# Altium project PDU-UV17.PrjPcb
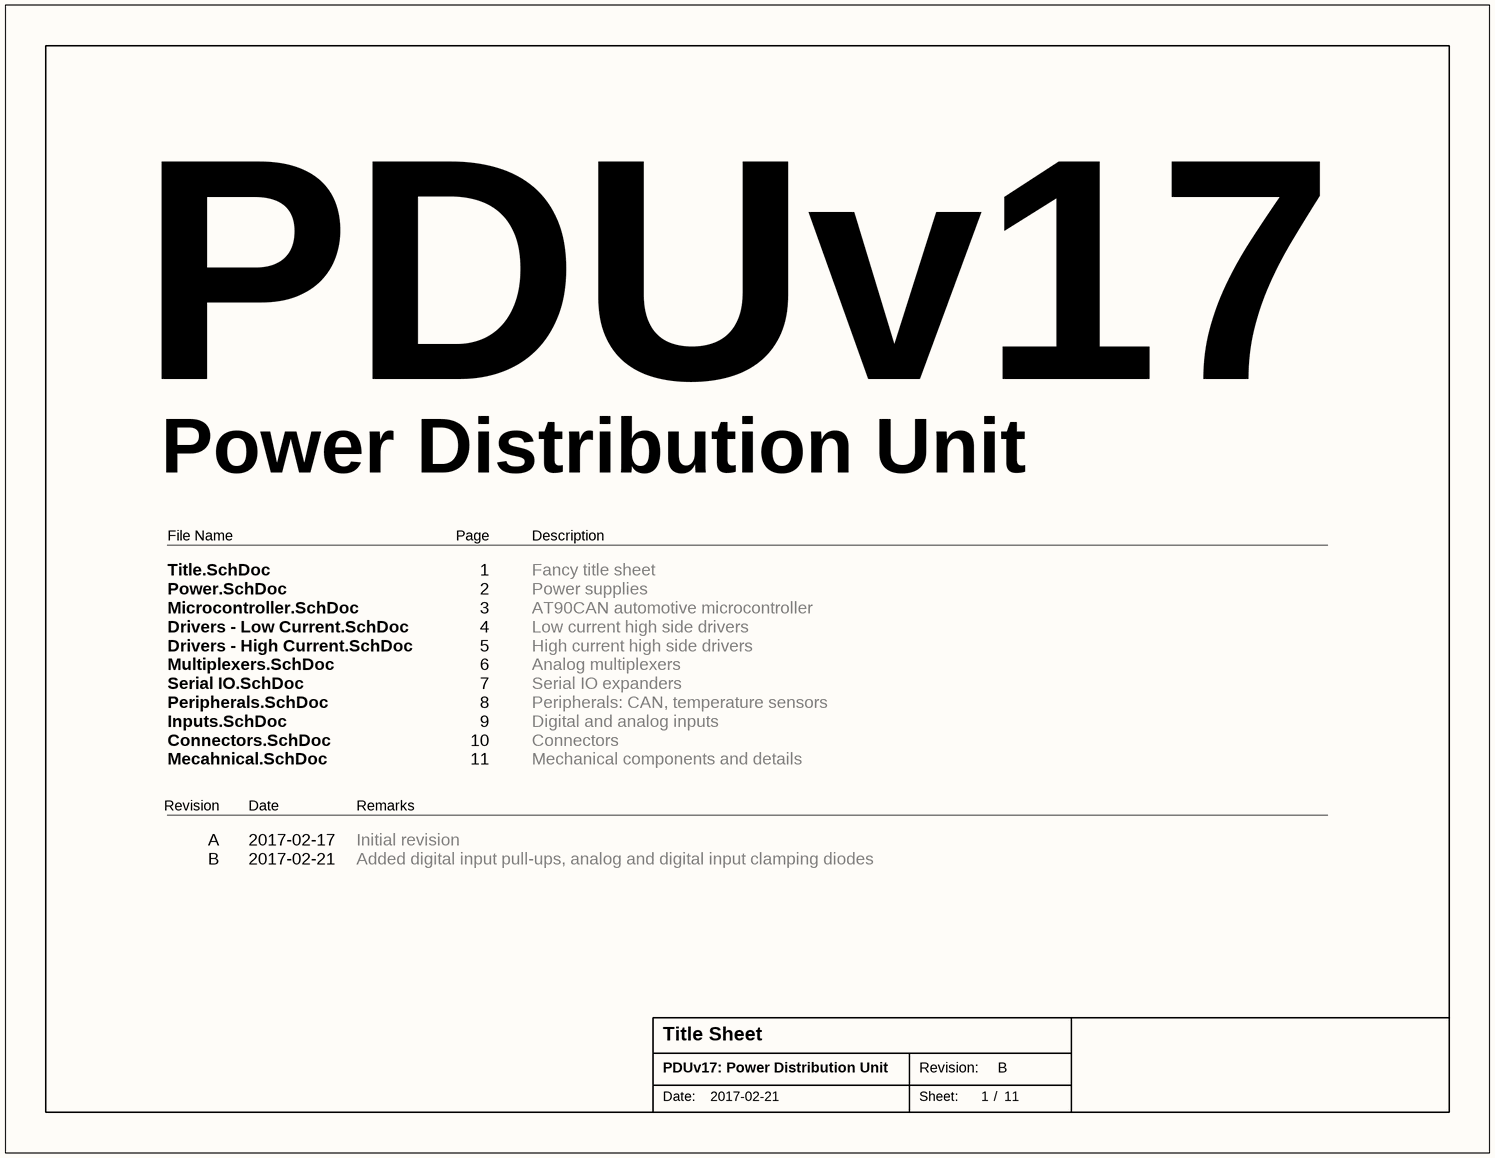
[diagram p0: Title.SchDoc]
ProjectDate: 2017-02-21; ProjectTitle: PDUv17: Power Distribution Unit; ProjectRevision: B; ProjectCar: UV17
11 sheets, 126 parts. Net scope: global (net labels, ports and power ports of the same name join across sheets).
Board file: PDU-UV17.PcbDoc
Sheets:
  Title.SchDoc
  Power.SchDoc
  Microcontroller.SchDoc
  Drivers - Low Current.SchDoc
  Drivers - High Current.SchDoc
  Multiplexers.SchDoc
  Serial IO.SchDoc
  Peripherals.SchDoc
  Inputs.SchDoc
  Connectors.SchDoc
  Mechanical.SchDoc

## Sheet Title.SchDoc: Title Sheet
size Letter; Date: 2017-02-17; Revision: A; SheetNumber: 1; SheetTotal: 11; ProjectTitle: PDUv17: Power Distribution Unit

### Notes on the sheet
- PDUv17
- Power Distribution Unit
- File Name
- Page
- Description
- Title.SchDoc
  Power.SchDoc
  Microcontroller.SchDoc
  Drivers - Low Current.SchDoc
  Drivers - High Current.SchDoc
  Multiplexers.SchDoc
  Serial IO.SchDoc
  Peripherals.SchDoc
  Inputs.SchDoc
  Connectors.SchDoc
  Mecahnical.SchDoc
- 1
  2
  3
  4
  5
  6
  7
  8
  9
  10
  11
- Fancy title sheet
  Power supplies
  AT90CAN automotive microcontroller
  Low current high side drivers
  High current high side drivers
  Analog multiplexers
  Serial IO expanders
  Peripherals: CAN, temperature sensors
  Digital and analog inputs
  Connectors
  Mechanical components and details
- Revision
- Date
- Remarks
- A
  B
- 2017-02-17
  2017-02-21
- Initial revision
  Added digital input pull-ups, analog and digital input clamping diodes
- Date:
- Revision:
- Sheet:
- /

## Sheet Power.SchDoc: Power Supplies
size Letter; Date: 2017-02-17; Revision: A; SheetNumber: 2; SheetTotal: 11; ProjectTitle: PDUv17: Power Distribution Unit
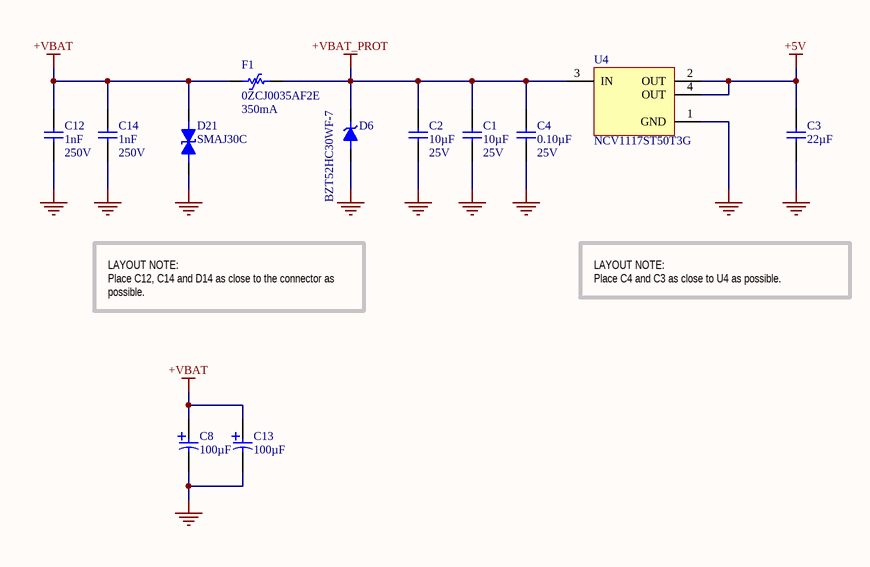
[diagram p1: Power.SchDoc]

### Parts
C1  value 10µF  Voltage: 25V  [CAP-1206-M]  (hidden comment: CAP 10µF ±10% 25V 1206 X7R)
C2  value 10µF  Voltage: 25V  [CAP-1206-M]  (hidden comment: CAP 10µF ±10% 25V 1206 X7R)
C3  value 22µF  [CAP-1206-M]  (hidden comment: CAP 22µF ±10% 10V 1206 X7R)
C4  value 0.10µF  Voltage: 25V  [CAP-0402-M]  (hidden comment: CAP 0.10µF ±10% 25V 0402 X7R)
C8  value 100µF  [CAPAE7066X80M]  (hidden comment: EEE-FK1V101XP)
C12  value 1nF  Voltage: 250V  [CAP-0805-M]  (hidden comment: CAP 1nF ±10% 250V 0805 X7R)
C13  value 100µF  [CAPAE7066X80M]  (hidden comment: EEE-FK1V101XP)
C14  value 1nF  Voltage: 250V  [CAP-0805-M]  (hidden comment: CAP 1nF ±10% 250V 0805 X7R)
D6  BZT52HC30WF-7  [SODFL340X115-2N]
D21  SMAJ30C  [SON127P500X135-2N]
F1  0ZCJ0035AF2E  value 350mA  [0ZCJ-1206-0.9]
U4  NCV1117ST50T3G  [SOT230P700X180-4N]

### Nets
+5V: C3.2 U4.2(OUT) U4.4(OUT)
+VBAT: C8.2 C12.1 C13.2 C14.1 D21.1 F1.1
+VBAT_PROT: C1.2 C2.2 C4.2 D6.1(K) F1.2 U4.3(IN)
GND: C1.1 C2.1 C3.1 C4.1 C8.1 C12.2 C13.1 C14.2 D6.2(A) D21.2 U4.1(GND)

### Notes on the sheet
- LAYOUT NOTE:
  Place C12, C14 and D14 as close to the connector as possible.
- LAYOUT NOTE:
  Place C4 and C3 as close to U4 as possible.
- Date:
- Revision:
- Sheet:
- /

### Library data of the parts
C1 C2 = CC1206KKX7R8BB106: Manufacturer: Yageo; Manufacturer Series: CC; Part Number: CC1206KKX7R8BB106; Component Type: Standard; Tolerance: ±10%; Package: 1206; Temperature Coefficient: X7R; Temperature Range: -55°C ~ 125°C; Supplier 1: Digi-Key; Supplier Part Number 1: 311-1959-1-ND
C3 = CC1206KKX7R6BB226: Manufacturer: Yageo; Manufacturer Series: CC; Part Number: CC1206KKX7R6BB226; Component Type: Standard; Tolerance: ±10%; Voltage: 10V; Package: 1206; Temperature Coefficient: X7R; Temperature Range: -55°C ~ 125°C; Supplier 1: Digi-Key; Supplier Part Number 1: 311-1954-1-ND
C4 = CC0402KRX7R8BB104: Manufacturer: Yageo; Manufacturer Series: CC; Part Number: CC0402KRX7R8BB104; Component Type: Standard; Tolerance: ±10%; Package: 0402; Temperature Coefficient: X7R; Temperature Range: -55°C ~ 125°C; Supplier 1: Digi-Key; Supplier Part Number 1: 311-2077-1-ND
C12 C14 = CC0805KRX7RYBB102: Manufacturer: Yageo; Manufacturer Series: CC; Part Number: CC0805KRX7RYBB102; Component Type: Standard; Tolerance: ±10%; Package: 0805; Temperature Coefficient: X7R; Temperature Range: -55°C ~ 125°C; Supplier 1: Digi-Key; Supplier Part Number 1: 311-1470-1-ND
C8 C13 = EEE-FK1V101XP: Supplier 1: Digi-Key; Supplier Part Number 1: PCE3836CT-ND
D6 = BZT52HC30WF-7: Supplier 1: Digi-Key; Supplier Part Number 1: BZT52HC30WF-7DICT-ND
U4 = NCV1117ST50T3G: Supplier 1: Digi-Key; Supplier Part Number 1: NCV1117ST50T3GOSCT-ND

## Sheet Microcontroller.SchDoc: Microcontroller
size Letter; Date: 2017-02-17; Revision: A; SheetNumber: 3; SheetTotal: 11; ProjectTitle: PDUv17: Power Distribution Unit
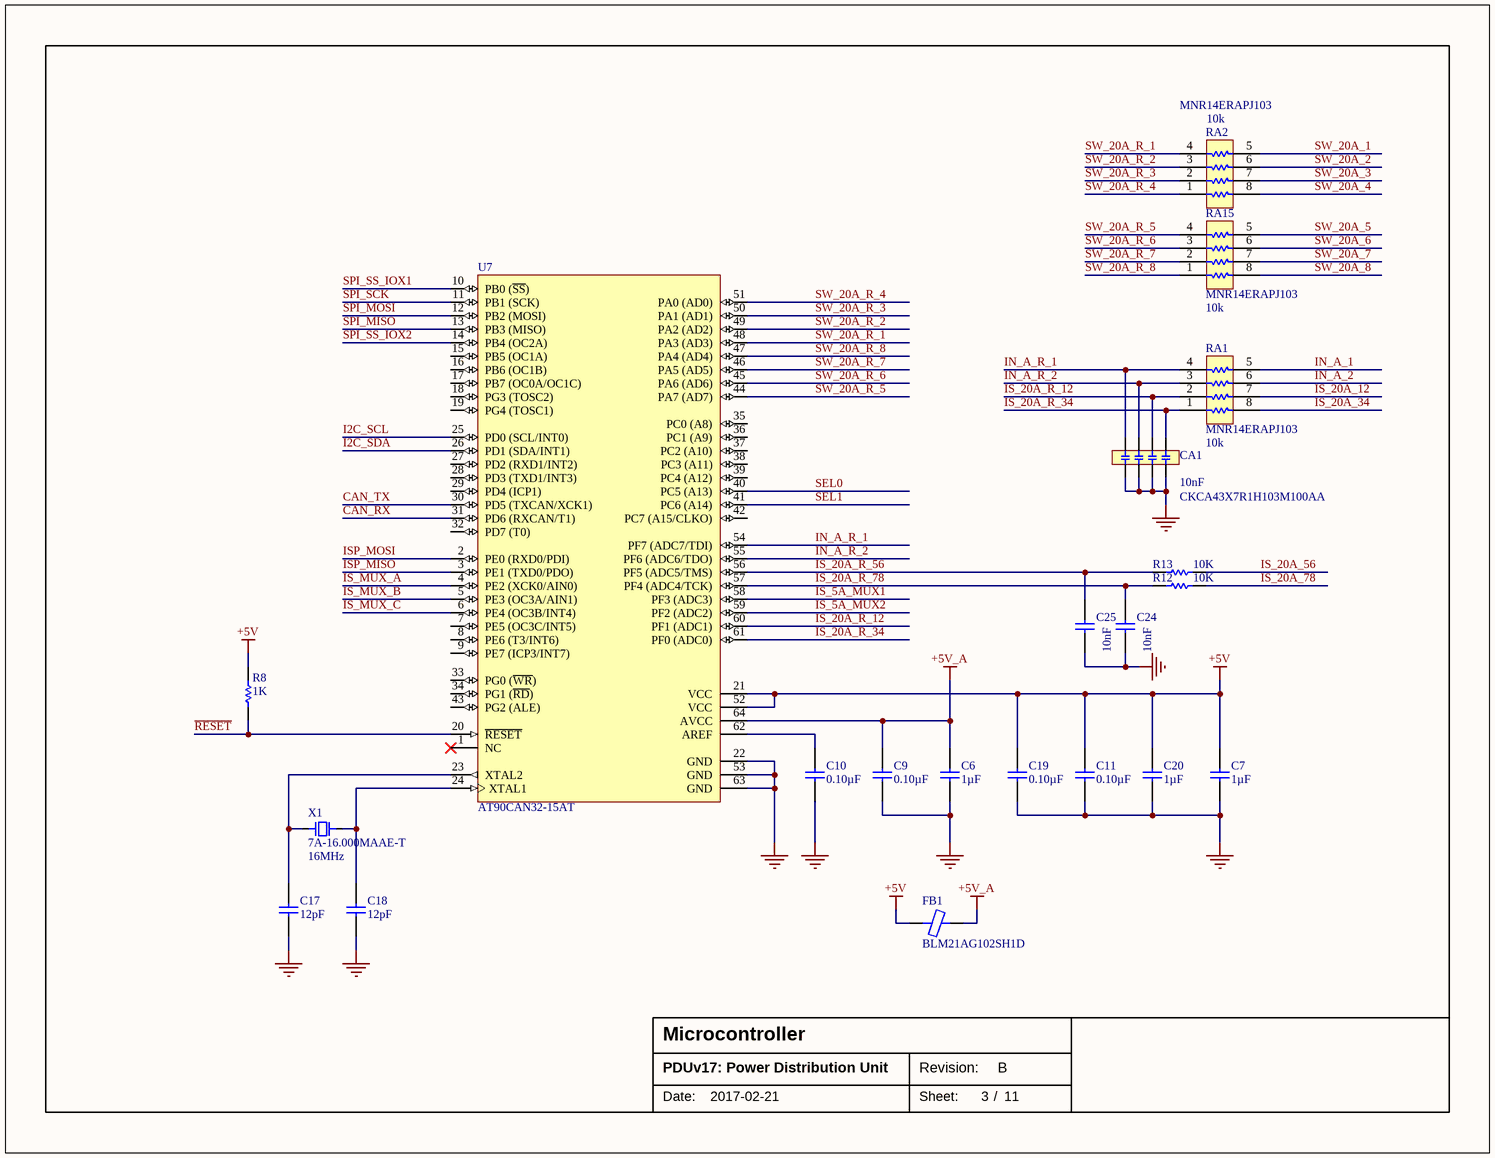
[diagram p2: Microcontroller.SchDoc]

### Parts
C6  value 1µF  [CAP-0805-M]  (hidden comment: CAP 1µF ±10% 16V 0805 X7R)
C7  value 1µF  [CAP-0805-M]  (hidden comment: CAP 1µF ±10% 16V 0805 X7R)
C9  value 0.10µF  [CAP-0402-M]  (hidden comment: CAP 0.10µF ±10% 16V 0402 X7R)
C10  value 0.10µF  [CAP-0402-M]  (hidden comment: CAP 0.10µF ±10% 16V 0402 X7R)
C11  value 0.10µF  [CAP-0402-M]  (hidden comment: CAP 0.10µF ±10% 16V 0402 X7R)
C17  value 12pF  [CAP-0402-M]  (hidden comment: CAP 12pF ±5% 50V 0402 C0G, NP0)
C18  value 12pF  [CAP-0402-M]  (hidden comment: CAP 12pF ±5% 50V 0402 C0G, NP0)
C19  value 0.10µF  [CAP-0402-M]  (hidden comment: CAP 0.10µF ±10% 16V 0402 X7R)
C20  value 1µF  [CAP-0805-M]  (hidden comment: CAP 1µF ±10% 16V 0805 X7R)
C24  value 10nF  [CAP-0402-M]  (hidden comment: CAP 10000pF ±10% 16V 0402 X7R)
C25  value 10nF  [CAP-0402-M]  (hidden comment: CAP 10000pF ±10% 16V 0402 X7R)
CA1  CKCA43X7R1H103M100AA  value 10nF  [CAF-80P319X159-8N]
FB1  BLM21AG102SH1D  [INDC2012X11N]
R8  value 1K  [RES-0603-M]  (hidden comment: RES 1K 1% 1/10 W 0603 ±100ppm/°C)
R12  value 10K  [RES-0603-M]  (hidden comment: RES 10K 1% 1/10 W 0603 ±100ppm/°C)
R13  value 10K  [RES-0603-M]  (hidden comment: RES 10K 1% 1/10 W 0603 ±100ppm/°C)
RA1  MNR14ERAPJ103  value 10k  [CAC-80P319X150-8N]
RA2  MNR14ERAPJ103  value 10k  [CAC-80P319X150-8N]
RA15  MNR14ERAPJ103  value 10k  [CAC-80P319X150-8N]
U7  AT90CAN32-15AT  [TQFP80P1600X1600X120-64N]
X1  7A-16.000MAAE-T  value 16MHz  [QFN200P500X320X135-2N]

### Nets
+5V: C7.1 C11.2 C19.2 C20.1 FB1.1 R8.1 U7.21(VCC) U7.52(VCC)
+5V_A: C6.1 C9.2 FB1.2 U7.64(AVCC)
GND: C6.2 C7.2 C9.1 C10.1 C11.1 C17.1 C18.1 C19.1 C20.2 C24.1 C25.1 CA1.1 CA1.2 CA1.3 CA1.4 U7.22(GND) U7.53(GND) U7.63(GND)
CAN_RX: U7.31(PD6_(RXCAN/T1))
CAN_TX: U7.30(PD5_(TXCAN/XCK1))
I2C_SCL: U7.25(PD0_(SCL/INT0))
I2C_SDA: U7.26(PD1_(SDA/INT1))
IN_A_1: RA1.5
IN_A_2: RA1.6
IN_A_R_1: CA1.5 RA1.4 U7.54(PF7_(ADC7/TDI))
IN_A_R_2: CA1.6 RA1.3 U7.55(PF6_(ADC6/TDO))
IS_5A_MUX1: U7.58(PF3_(ADC3))
IS_5A_MUX2: U7.59(PF2_(ADC2))
IS_20A_12: RA1.7
IS_20A_34: RA1.8
IS_20A_56: R13.1
IS_20A_78: R12.1
IS_20A_R_12: CA1.7 RA1.2 U7.60(PF1_(ADC1))
IS_20A_R_34: CA1.8 RA1.1 U7.61(PF0_(ADC0))
IS_20A_R_56: C25.2 R13.2 U7.56(PF5_(ADC5/TMS))
IS_20A_R_78: C24.2 R12.2 U7.57(PF4_(ADC4/TCK))
IS_MUX_A: U7.4(PE2_(XCK0/AIN0))
IS_MUX_B: U7.5(PE3_(OC3A/AIN1))
IS_MUX_C: U7.6(PE4_(OC3B/INT4))
ISP_MISO: U7.3(PE1_(TXD0/PDO))
ISP_MOSI: U7.2(PE0_(RXD0/PDI))
~{RESET}: R8.2 U7.20(~{RESET})
SEL0: U7.40(PC5_(A13))
SEL1: U7.41(PC6_(A14))
SPI_MISO: U7.13(PB3_(MISO))
SPI_MOSI: U7.12(PB2_(MOSI))
SPI_SCK: U7.11(PB1_(SCK))
SPI_SS_IOX1: U7.10(PB0_(~{SS}))
SPI_SS_IOX2: U7.14(PB4_(OC2A))
SW_20A_1: RA2.5
SW_20A_2: RA2.6
SW_20A_3: RA2.7
SW_20A_4: RA2.8
SW_20A_5: RA15.5
SW_20A_6: RA15.6
SW_20A_7: RA15.7
SW_20A_8: RA15.8
SW_20A_R_1: RA2.4 U7.48(PA3_(AD3))
SW_20A_R_2: RA2.3 U7.49(PA2_(AD2))
SW_20A_R_3: RA2.2 U7.50(PA1_(AD1))
SW_20A_R_4: RA2.1 U7.51(PA0_(AD0))
SW_20A_R_5: RA15.4 U7.44(PA7_(AD7))
SW_20A_R_6: RA15.3 U7.45(PA6_(AD6))
SW_20A_R_7: RA15.2 U7.46(PA5_(AD5))
SW_20A_R_8: RA15.1 U7.47(PA4_(AD4))
NetC10_2: C10.2 U7.62(AREF)
NetC17_2: C17.2 U7.23(XTAL2) X1.1
NetC18_2: C18.2 U7.24(XTAL1) X1.2

Not connected (* = marked no-connect by the designer): U7 1(NC)* 7(PE5_(OC3C/INT5)) 8(PE6_(T3/INT6)) 9(PE7_(ICP3/INT7)) 15(PB5_(OC1A)) 16(PB6_(OC1B)) 17(PB7_(OC0A/OC1C)) 18(PG3_(TOSC2)) 19(PG4_(TOSC1)) 27(PD2_(RXD1/INT2)) 28(PD3_(TXD1/INT3)) 29(PD4_(ICP1)) 32(PD7_(T0)) 33(PG0_(~{WR})) 34(PG1_(~{RD})) 35(PC0_(A8)) 36(PC1_(A9)) 37(PC2_(A10)) 38(PC3_(A11)) 39(PC4_(A12)) 42(PC7_(A15/CLKO)) 43(PG2_(ALE))

### Notes on the sheet
- Date:
- Revision:
- Sheet:
- /

### Library data of the parts
C6 C7 C20 = CC0805KKX7R7BB105: Manufacturer: Yageo; Manufacturer Series: CC; Part Number: CC0805KKX7R7BB105; Component Type: Standard; Tolerance: ±10%; Voltage: 16V; Package: 0805; Temperature Coefficient: X7R; Temperature Range: -55°C ~ 125°C; Supplier 1: Digi-Key; Supplier Part Number 1: 311-1365-1-ND
C9-C11 C19 = CC0402KRX7R7BB104: Manufacturer: Yageo; Manufacturer Series: CC; Part Number: CC0402KRX7R7BB104; Component Type: Standard; Tolerance: ±10%; Voltage: 16V; Package: 0402; Temperature Coefficient: X7R; Temperature Range: -55°C ~ 125°C; Supplier 1: Digi-Key; Supplier Part Number 1: 311-1338-1-ND
C17 C18 = CC0402JRNPO9BN120: Manufacturer: Yageo; Manufacturer Series: CC; Part Number: CC0402JRNPO9BN120; Component Type: Standard; Tolerance: ±5%; Voltage: 50V; Package: 0402; Temperature Coefficient: C0G, NP0; Temperature Range: -55°C ~ 125°C; Supplier 1: Digi-Key; Supplier Part Number 1: 311-1016-1-ND
C24 C25 = CC0402KRX7R7BB103: Manufacturer: Yageo; Manufacturer Series: CC; Part Number: CC0402KRX7R7BB103; Component Type: Standard; Tolerance: ±10%; Voltage: 16V; Package: 0402; Temperature Coefficient: X7R; Temperature Range: -55°C ~ 125°C; Supplier 1: Digi-Key; Supplier Part Number 1: 311-1042-1-ND
R8 = RC0603FR-071KL: Manufacturer: Yageo; Manufacturer Series: RC; Power: 1/10 W; Part Number: RC0603FR-071KL; Component Type: Standard; Tolerance: 1%; Package: 0603; Temperature Coefficient: ±100ppm/°C; Temperature Range: -55°C ~ 155°C; Supplier 1: Digi-Key; Supplier Part Number 1: 311-1.00KHRCT-ND
R12 R13 = RC0603FR-0710KL: Manufacturer: Yageo; Manufacturer Series: RC; Power: 1/10 W; Part Number: RC0603FR-0710KL; Component Type: Standard; Tolerance: 1%; Package: 0603; Temperature Coefficient: ±100ppm/°C; Temperature Range: -55°C ~ 155°C; Supplier 1: Digi-Key; Supplier Part Number 1: 311-10.0KHRCT-ND
X1 = 7A-16.000MAAE-T: SMD Crystal Oscillator 12 pF; Load Capacitance: 12pF; Supplier 1: Digi-Key; Supplier Part Number 1: 887-1747-1-ND
FB1 = BLM21AG102SH1D: Supplier 1: Digi-Key; Supplier Part Number 1: 490-10664-1-ND
U7 = AT90CAN32-15AT: Supplier 1: Digi-Key; Supplier Part Number 1: AT90CAN32-15ATCT-ND

## Sheet Drivers - Low Current.SchDoc: Low Current Drivers
size Letter; Date: 2017-02-17; Revision: A; SheetNumber: 4; SheetTotal: 11; ProjectTitle: PDUv17: Power Distribution Unit
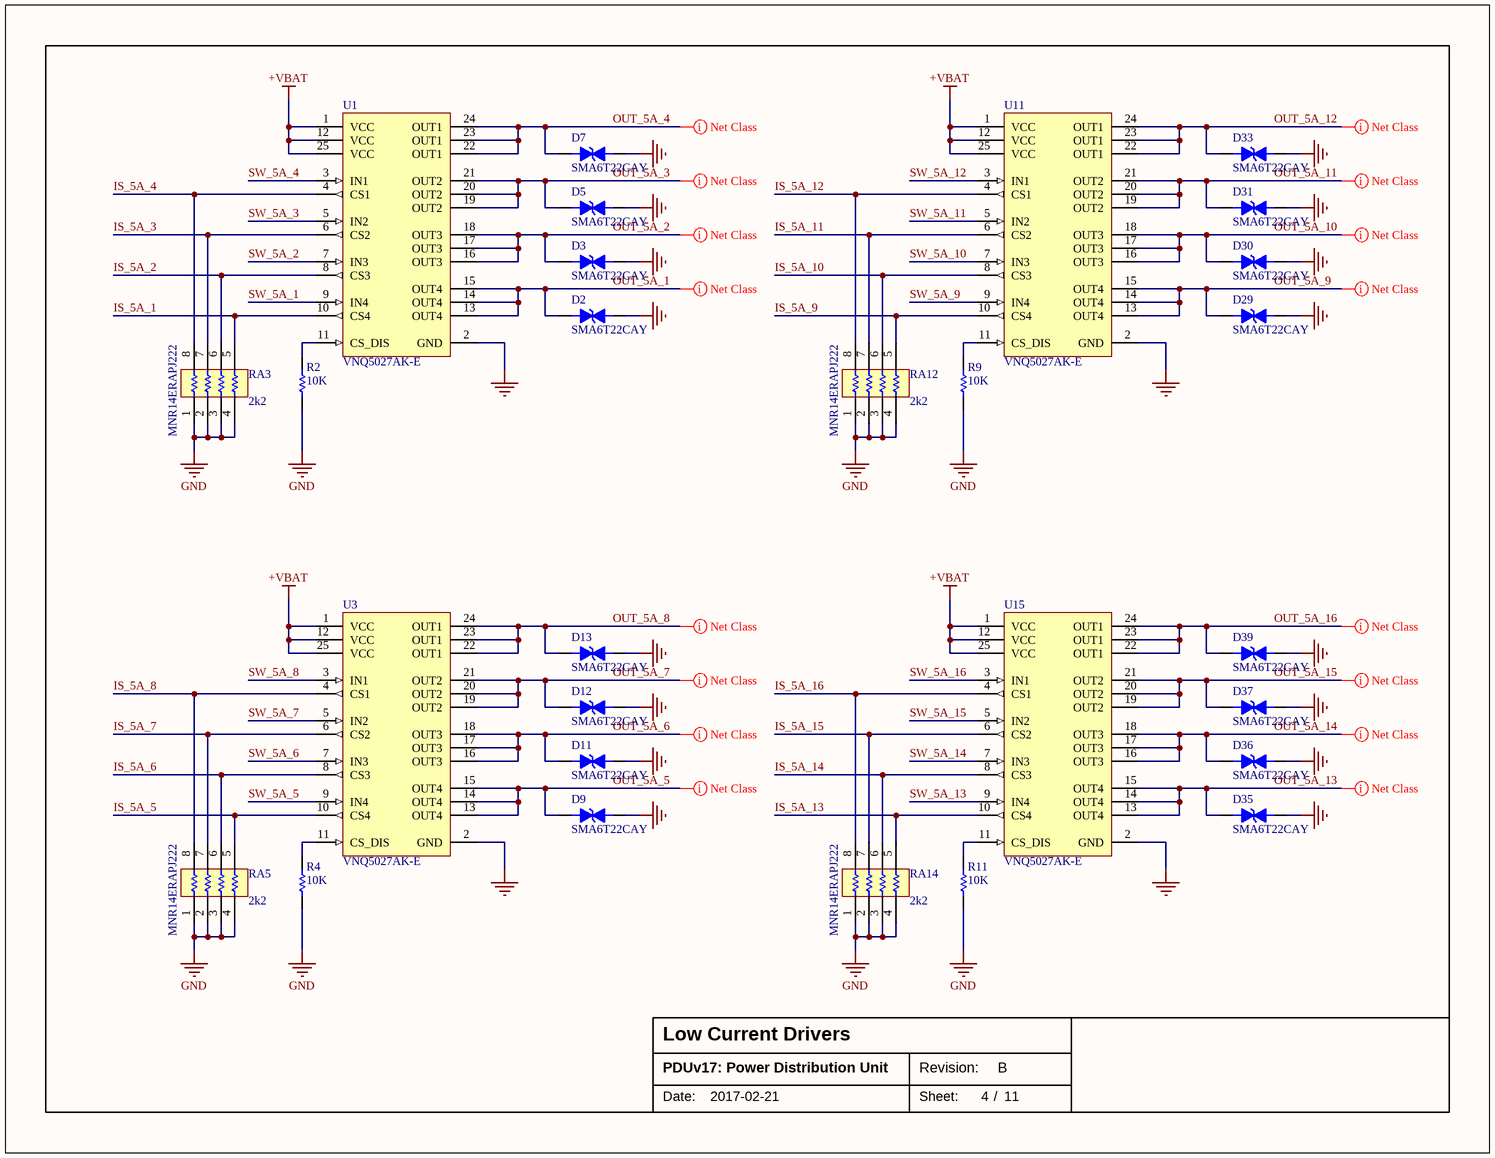
[diagram p3: Drivers - Low Current.SchDoc]

### Parts
D2  SMA6T22CAY  [DIOM4326X25N]
D3  SMA6T22CAY  [DIOM4326X25N]
D5  SMA6T22CAY  [DIOM4326X25N]
D7  SMA6T22CAY  [DIOM4326X25N]
D9  SMA6T22CAY  [DIOM4326X25N]
D11  SMA6T22CAY  [DIOM4326X25N]
D12  SMA6T22CAY  [DIOM4326X25N]
D13  SMA6T22CAY  [DIOM4326X25N]
D29  SMA6T22CAY  [DIOM4326X25N]
D30  SMA6T22CAY  [DIOM4326X25N]
D31  SMA6T22CAY  [DIOM4326X25N]
D33  SMA6T22CAY  [DIOM4326X25N]
D35  SMA6T22CAY  [DIOM4326X25N]
D36  SMA6T22CAY  [DIOM4326X25N]
D37  SMA6T22CAY  [DIOM4326X25N]
D39  SMA6T22CAY  [DIOM4326X25N]
R2  value 10K  [RES-0603-M]  (hidden comment: RES 10K 1% 1/10 W 0603 ±100ppm/°C)
R4  value 10K  [RES-0603-M]  (hidden comment: RES 10K 1% 1/10 W 0603 ±100ppm/°C)
R9  value 10K  [RES-0603-M]  (hidden comment: RES 10K 1% 1/10 W 0603 ±100ppm/°C)
R11  value 10K  [RES-0603-M]  (hidden comment: RES 10K 1% 1/10 W 0603 ±100ppm/°C)
RA3  MNR14ERAPJ222  value 2k2  [CAC-80P319X150-8N]
RA5  MNR14ERAPJ222  value 2k2  [CAC-80P319X150-8N]
RA12  MNR14ERAPJ222  value 2k2  [CAC-80P319X150-8N]
RA14  MNR14ERAPJ222  value 2k2  [CAC-80P319X150-8N]
U1  VNQ5027AK-E  [SOP80P1030X245_HS-25N]
U3  VNQ5027AK-E  [SOP80P1030X245_HS-25N]
U11  VNQ5027AK-E  [SOP80P1030X245_HS-25N]
U15  VNQ5027AK-E  [SOP80P1030X245_HS-25N]

### Nets
+VBAT: U1.1(VCC) U1.12(VCC) U1.25(VCC) U3.1(VCC) U3.12(VCC) U3.25(VCC) U11.1(VCC) U11.12(VCC) U11.25(VCC) U15.1(VCC) U15.12(VCC) U15.25(VCC)
GND: D2.1(K) D3.1(K) D5.1(K) D7.1(K) D9.1(K) D11.1(K) D12.1(K) D13.1(K) D29.1(K) D30.1(K) D31.1(K) D33.1(K) D35.1(K) D36.1(K) D37.1(K) D39.1(K) R2.1 R4.1 R9.1 R11.1 RA3.1 RA3.2 RA3.3 RA3.4 RA5.1 RA5.2 RA5.3 RA5.4 RA12.1 RA12.2 RA12.3 RA12.4 RA14.1 RA14.2 RA14.3 RA14.4 U1.2(GND) U3.2(GND) U11.2(GND) U15.2(GND)
IS_5A_1: RA3.5 U1.10(CS4)
IS_5A_2: RA3.6 U1.8(CS3)
IS_5A_3: RA3.7 U1.6(CS2)
IS_5A_4: RA3.8 U1.4(CS1)
IS_5A_5: RA5.5 U3.10(CS4)
IS_5A_6: RA5.6 U3.8(CS3)
IS_5A_7: RA5.7 U3.6(CS2)
IS_5A_8: RA5.8 U3.4(CS1)
IS_5A_9: RA12.5 U11.10(CS4)
IS_5A_10: RA12.6 U11.8(CS3)
IS_5A_11: RA12.7 U11.6(CS2)
IS_5A_12: RA12.8 U11.4(CS1)
IS_5A_13: RA14.5 U15.10(CS4)
IS_5A_14: RA14.6 U15.8(CS3)
IS_5A_15: RA14.7 U15.6(CS2)
IS_5A_16: RA14.8 U15.4(CS1)
OUT_5A_1: D2.2(A) U1.13(OUT4) U1.14(OUT4) U1.15(OUT4)
OUT_5A_2: D3.2(A) U1.16(OUT3) U1.17(OUT3) U1.18(OUT3)
OUT_5A_3: D5.2(A) U1.19(OUT2) U1.20(OUT2) U1.21(OUT2)
OUT_5A_4: D7.2(A) U1.22(OUT1) U1.23(OUT1) U1.24(OUT1)
OUT_5A_5: D9.2(A) U3.13(OUT4) U3.14(OUT4) U3.15(OUT4)
OUT_5A_6: D11.2(A) U3.16(OUT3) U3.17(OUT3) U3.18(OUT3)
OUT_5A_7: D12.2(A) U3.19(OUT2) U3.20(OUT2) U3.21(OUT2)
OUT_5A_8: D13.2(A) U3.22(OUT1) U3.23(OUT1) U3.24(OUT1)
OUT_5A_9: D29.2(A) U11.13(OUT4) U11.14(OUT4) U11.15(OUT4)
OUT_5A_10: D30.2(A) U11.16(OUT3) U11.17(OUT3) U11.18(OUT3)
OUT_5A_11: D31.2(A) U11.19(OUT2) U11.20(OUT2) U11.21(OUT2)
OUT_5A_12: D33.2(A) U11.22(OUT1) U11.23(OUT1) U11.24(OUT1)
OUT_5A_13: D35.2(A) U15.13(OUT4) U15.14(OUT4) U15.15(OUT4)
OUT_5A_14: D36.2(A) U15.16(OUT3) U15.17(OUT3) U15.18(OUT3)
OUT_5A_15: D37.2(A) U15.19(OUT2) U15.20(OUT2) U15.21(OUT2)
OUT_5A_16: D39.2(A) U15.22(OUT1) U15.23(OUT1) U15.24(OUT1)
SW_5A_1: U1.9(IN4)
SW_5A_2: U1.7(IN3)
SW_5A_3: U1.5(IN2)
SW_5A_4: U1.3(IN1)
SW_5A_5: U3.9(IN4)
SW_5A_6: U3.7(IN3)
SW_5A_7: U3.5(IN2)
SW_5A_8: U3.3(IN1)
SW_5A_9: U11.9(IN4)
SW_5A_10: U11.7(IN3)
SW_5A_11: U11.5(IN2)
SW_5A_12: U11.3(IN1)
SW_5A_13: U15.9(IN4)
SW_5A_14: U15.7(IN3)
SW_5A_15: U15.5(IN2)
SW_5A_16: U15.3(IN1)
NetR2_2: R2.2 U1.11(CS_DIS)
NetR4_2: R4.2 U3.11(CS_DIS)
NetR9_2: R9.2 U11.11(CS_DIS)
NetR11_2: R11.2 U15.11(CS_DIS)

### Layout directives
net class OUT_5A: OUT_5A_1, OUT_5A_2, OUT_5A_3, OUT_5A_4, OUT_5A_5, OUT_5A_6, OUT_5A_7, OUT_5A_8, OUT_5A_9, OUT_5A_10, OUT_5A_11, OUT_5A_12, OUT_5A_13, OUT_5A_14, OUT_5A_15, OUT_5A_16

### Notes on the sheet
- Date:
- Revision:
- Sheet:
- /

### Library data of the parts
R2 R4 R9 R11 = RC0603FR-0710KL: as R12 on sheet Microcontroller; Part Number: RC0603FR-0710KL; Component Type: Standard; Tolerance: 1%; Package: 0603; Temperature Coefficient: ±100ppm/°C; Temperature Range: -55°C ~ 155°C; Supplier 1: Digi-Key; Supplier Part Number 1: 311-10.0KHRCT-ND
U1 U3 U11 U15 = VNQ5027AK-E: Supplier 1: Digi-Key; Supplier Part Number 1: 497-11715-1-ND

## Sheet Drivers - High Current.SchDoc: High Current Drivers
size Letter; Date: 2017-02-17; Revision: A; SheetNumber: 5; SheetTotal: 11; ProjectTitle: PDUv17: Power Distribution Unit
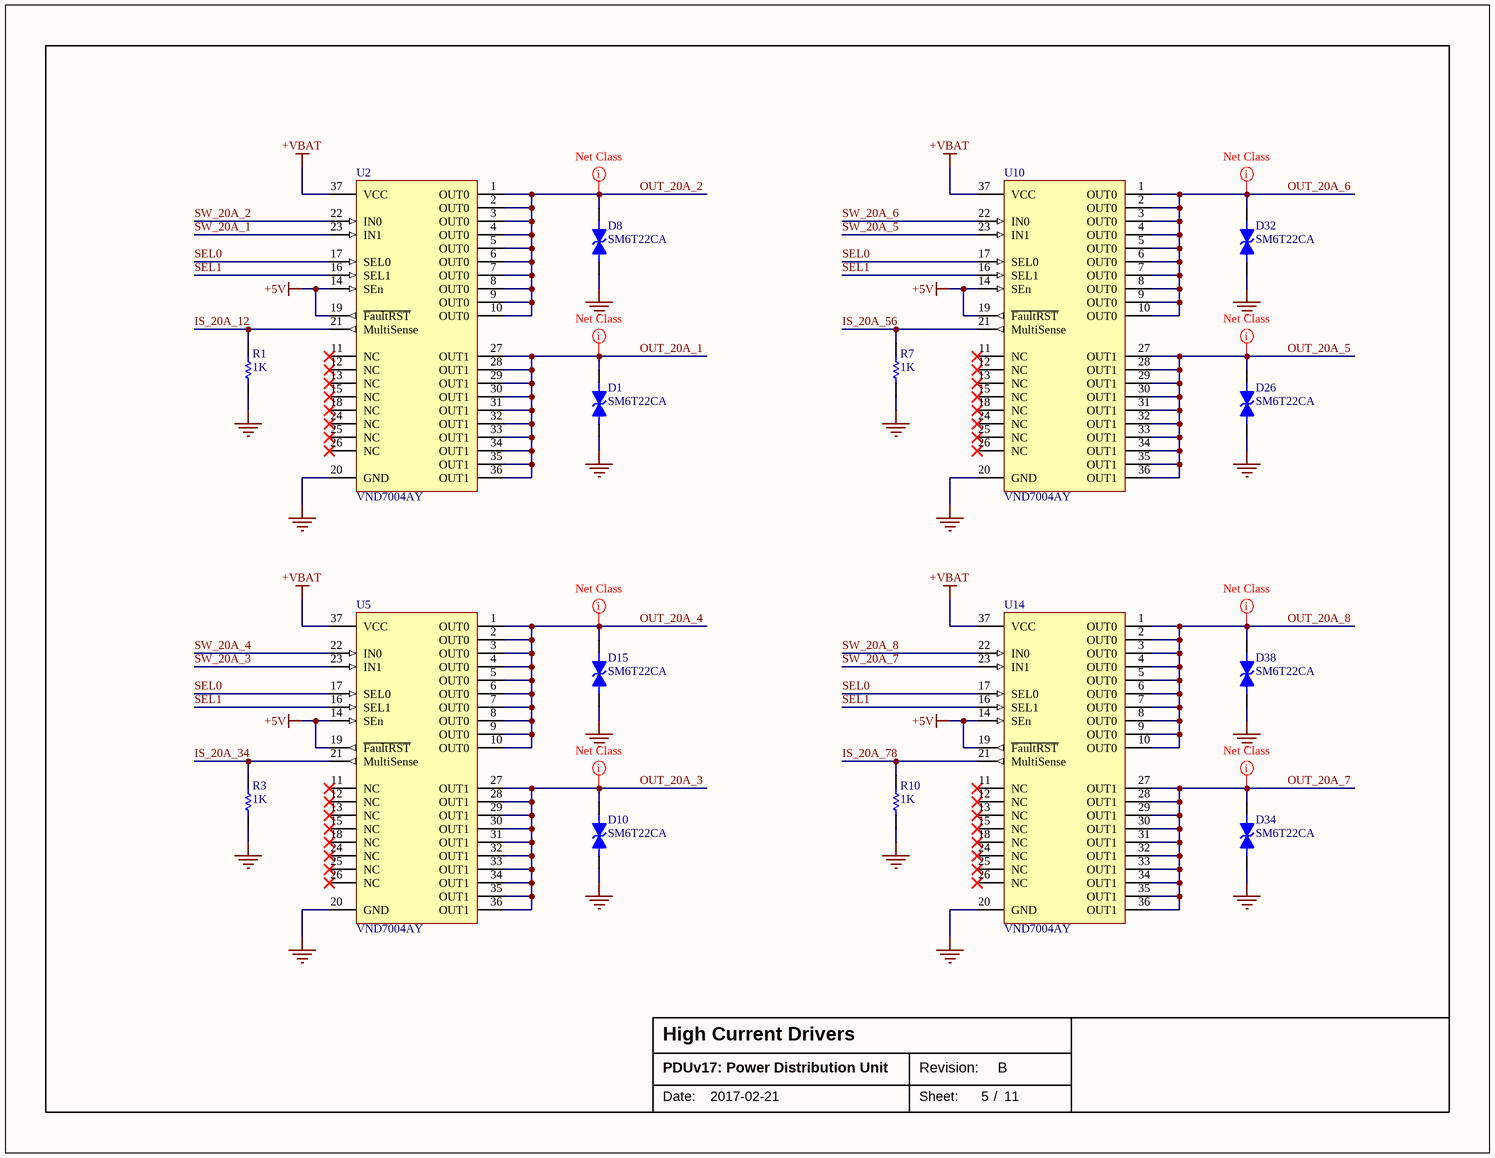
[diagram p4: Drivers - High Current.SchDoc]

### Parts
D1  SM6T22CA  [SM6T]
D8  SM6T22CA  [SM6T]
D10  SM6T22CA  [SM6T]
D15  SM6T22CA  [SM6T]
D26  SM6T22CA  [SM6T]
D32  SM6T22CA  [SM6T]
D34  SM6T22CA  [SM6T]
D38  SM6T22CA  [SM6T]
R1  value 1K  [RES-0603-M]  (hidden comment: RES 1K 1% 1/10 W 0603 ±100ppm/°C)
R3  value 1K  [RES-0603-M]  (hidden comment: RES 1K 1% 1/10 W 0603 ±100ppm/°C)
R7  value 1K  [RES-0603-M]  (hidden comment: RES 1K 1% 1/10 W 0603 ±100ppm/°C)
R10  value 1K  [RES-0603-M]  (hidden comment: RES 1K 1% 1/10 W 0603 ±100ppm/°C)
U2  VND7004AY  [SSOP50P1030X265_HS-37N]
U5  VND7004AY  [SSOP50P1030X265_HS-37N]
U10  VND7004AY  [SSOP50P1030X265_HS-37N]
U14  VND7004AY  [SSOP50P1030X265_HS-37N]

### Nets
+5V: U2.14(SEn) U2.19(~{FaultRST}) U5.14(SEn) U5.19(~{FaultRST}) U10.14(SEn) U10.19(~{FaultRST}) U14.14(SEn) U14.19(~{FaultRST})
+VBAT: U2.37(VCC) U5.37(VCC) U10.37(VCC) U14.37(VCC)
GND: D1.1(K) D8.1(K) D10.1(K) D15.1(K) D26.1(K) D32.1(K) D34.1(K) D38.1(K) R1.1 R3.1 R7.1 R10.1 U2.20(GND) U5.20(GND) U10.20(GND) U14.20(GND)
IS_20A_12: R1.2 U2.21(MultiSense)
IS_20A_34: R3.2 U5.21(MultiSense)
IS_20A_56: R7.2 U10.21(MultiSense)
IS_20A_78: R10.2 U14.21(MultiSense)
OUT_20A_1: D1.2(A) U2.27(OUT1) U2.28(OUT1) U2.29(OUT1) U2.30(OUT1) U2.31(OUT1) U2.32(OUT1) U2.33(OUT1) U2.34(OUT1) U2.35(OUT1) U2.36(OUT1)
OUT_20A_2: D8.2(A) U2.1(OUT0) U2.2(OUT0) U2.3(OUT0) U2.4(OUT0) U2.5(OUT0) U2.6(OUT0) U2.7(OUT0) U2.8(OUT0) U2.9(OUT0) U2.10(OUT0)
OUT_20A_3: D10.2(A) U5.27(OUT1) U5.28(OUT1) U5.29(OUT1) U5.30(OUT1) U5.31(OUT1) U5.32(OUT1) U5.33(OUT1) U5.34(OUT1) U5.35(OUT1) U5.36(OUT1)
OUT_20A_4: D15.2(A) U5.1(OUT0) U5.2(OUT0) U5.3(OUT0) U5.4(OUT0) U5.5(OUT0) U5.6(OUT0) U5.7(OUT0) U5.8(OUT0) U5.9(OUT0) U5.10(OUT0)
OUT_20A_5: D26.2(A) U10.27(OUT1) U10.28(OUT1) U10.29(OUT1) U10.30(OUT1) U10.31(OUT1) U10.32(OUT1) U10.33(OUT1) U10.34(OUT1) U10.35(OUT1) U10.36(OUT1)
OUT_20A_6: D32.2(A) U10.1(OUT0) U10.2(OUT0) U10.3(OUT0) U10.4(OUT0) U10.5(OUT0) U10.6(OUT0) U10.7(OUT0) U10.8(OUT0) U10.9(OUT0) U10.10(OUT0)
OUT_20A_7: D34.2(A) U14.27(OUT1) U14.28(OUT1) U14.29(OUT1) U14.30(OUT1) U14.31(OUT1) U14.32(OUT1) U14.33(OUT1) U14.34(OUT1) U14.35(OUT1) U14.36(OUT1)
OUT_20A_8: D38.2(A) U14.1(OUT0) U14.2(OUT0) U14.3(OUT0) U14.4(OUT0) U14.5(OUT0) U14.6(OUT0) U14.7(OUT0) U14.8(OUT0) U14.9(OUT0) U14.10(OUT0)
SEL0: U2.17(SEL0) U5.17(SEL0) U10.17(SEL0) U14.17(SEL0)
SEL1: U2.16(SEL1) U5.16(SEL1) U10.16(SEL1) U14.16(SEL1)
SW_20A_1: U2.23(IN1)
SW_20A_2: U2.22(IN0)
SW_20A_3: U5.23(IN1)
SW_20A_4: U5.22(IN0)
SW_20A_5: U10.23(IN1)
SW_20A_6: U10.22(IN0)
SW_20A_7: U14.23(IN1)
SW_20A_8: U14.22(IN0)

Not connected (* = marked no-connect by the designer): U2 11(NC)* 12(NC)* 13(NC)* 15(NC)* 18(NC)* 24(NC)* 25(NC)* 26(NC)*; U5 11(NC)* 12(NC)* 13(NC)* 15(NC)* 18(NC)* 24(NC)* 25(NC)* 26(NC)*; U10 11(NC)* 12(NC)* 13(NC)* 15(NC)* 18(NC)* 24(NC)* 25(NC)* 26(NC)*; U14 11(NC)* 12(NC)* 13(NC)* 15(NC)* 18(NC)* 24(NC)* 25(NC)* 26(NC)*

### Layout directives
net class OUT_20A: OUT_20A_1, OUT_20A_2, OUT_20A_3, OUT_20A_4, OUT_20A_5, OUT_20A_6, OUT_20A_7, OUT_20A_8

### Notes on the sheet
- Date:
- Revision:
- Sheet:
- /

### Library data of the parts
R1 R3 R7 R10 = RC0603FR-071KL: as R8 on sheet Microcontroller; Part Number: RC0603FR-071KL; Component Type: Standard; Tolerance: 1%; Package: 0603; Temperature Coefficient: ±100ppm/°C; Temperature Range: -55°C ~ 155°C; Supplier 1: Digi-Key; Supplier Part Number 1: 311-1.00KHRCT-ND
D1 D8 D10 D15 D26 D32 D34 D38 = SM6T22CA: Supplier 1: Digi-Key; Supplier Part Number 1: 497-3507-1-ND

## Sheet Multiplexers.SchDoc: Peripherals
size Letter; Date: 2017-02-17; Revision: A; SheetNumber: 6; SheetTotal: 11; ProjectTitle: PDUv17: Power Distribution Unit
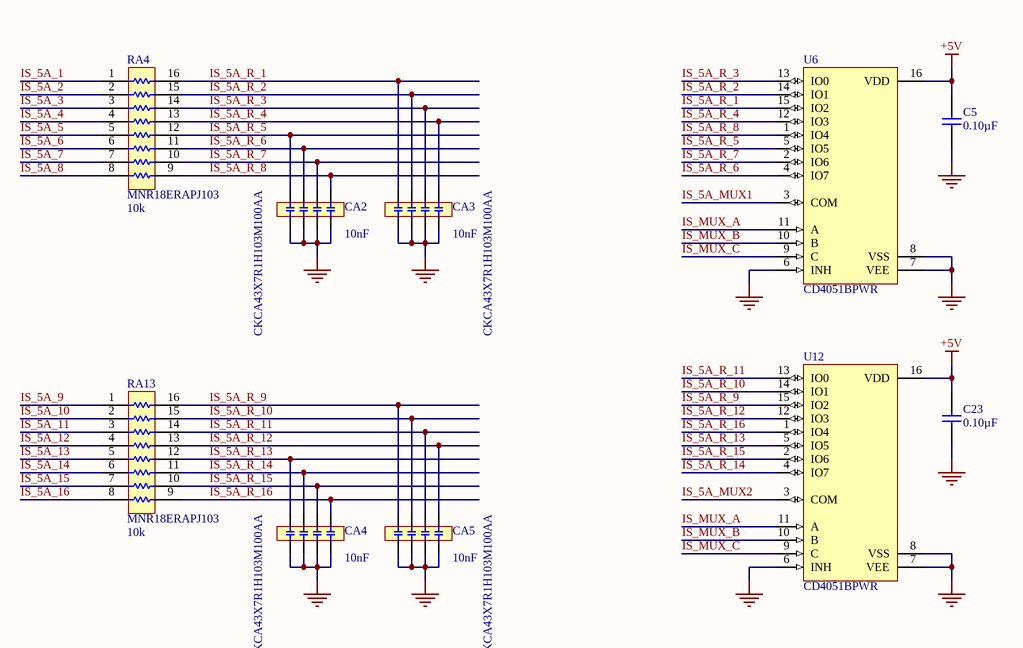
[diagram p5: Multiplexers.SchDoc]

### Parts
C5  value 0.10µF  [CAP-0402-M]  (hidden comment: CAP 0.10µF ±10% 16V 0402 X7R)
C23  value 0.10µF  [CAP-0402-M]  (hidden comment: CAP 0.10µF ±10% 16V 0402 X7R)
CA2  CKCA43X7R1H103M100AA  value 10nF  [CAF-80P319X159-8N]
CA3  CKCA43X7R1H103M100AA  value 10nF  [CAF-80P319X159-8N]
CA4  CKCA43X7R1H103M100AA  value 10nF  [CAF-80P319X159-8N]
CA5  CKCA43X7R1H103M100AA  value 10nF  [CAF-80P319X159-8N]
RA4  MNR18ERAPJ103  value 10k  [CAC-50P379X150-16N]
RA13  MNR18ERAPJ103  value 10k  [CAC-50P379X150-16N]
U6  CD4051BPWR  [TSOP65P640X120-16N]
U12  CD4051BPWR  [TSOP65P640X120-16N]

### Nets
+5V: C5.2 C23.2 U6.16(VDD) U12.16(VDD)
GND: C5.1 C23.1 CA2.1 CA2.2 CA2.3 CA2.4 CA3.1 CA3.2 CA3.3 CA3.4 CA4.1 CA4.2 CA4.3 CA4.4 CA5.5 CA5.6 CA5.7 CA5.8 U6.6(INH) U6.7(VEE) U6.8(VSS) U12.6(INH) U12.7(VEE) U12.8(VSS)
IS_5A_1: RA4.1
IS_5A_2: RA4.2
IS_5A_3: RA4.3
IS_5A_4: RA4.4
IS_5A_5: RA4.5
IS_5A_6: RA4.6
IS_5A_7: RA4.7
IS_5A_8: RA4.8
IS_5A_9: RA13.1
IS_5A_10: RA13.2
IS_5A_11: RA13.3
IS_5A_12: RA13.4
IS_5A_13: RA13.5
IS_5A_14: RA13.6
IS_5A_15: RA13.7
IS_5A_16: RA13.8
IS_5A_MUX1: U6.3(COM)
IS_5A_MUX2: U12.3(COM)
IS_5A_R_1: CA3.5 RA4.16 U6.15(IO2)
IS_5A_R_2: CA3.6 RA4.15 U6.14(IO1)
IS_5A_R_3: CA3.7 RA4.14 U6.13(IO0)
IS_5A_R_4: CA3.8 RA4.13 U6.12(IO3)
IS_5A_R_5: CA2.5 RA4.12 U6.5(IO5)
IS_5A_R_6: CA2.6 RA4.11 U6.4(IO7)
IS_5A_R_7: CA2.7 RA4.10 U6.2(IO6)
IS_5A_R_8: CA2.8 RA4.9 U6.1(IO4)
IS_5A_R_9: CA5.1 RA13.16 U12.15(IO2)
IS_5A_R_10: CA5.2 RA13.15 U12.14(IO1)
IS_5A_R_11: CA5.3 RA13.14 U12.13(IO0)
IS_5A_R_12: CA5.4 RA13.13 U12.12(IO3)
IS_5A_R_13: CA4.5 RA13.12 U12.5(IO5)
IS_5A_R_14: CA4.6 RA13.11 U12.4(IO7)
IS_5A_R_15: CA4.7 RA13.10 U12.2(IO6)
IS_5A_R_16: CA4.8 RA13.9 U12.1(IO4)
IS_MUX_A: U6.11(A) U12.11(A)
IS_MUX_B: U6.10(B) U12.10(B)
IS_MUX_C: U6.9(C) U12.9(C)

### Notes on the sheet
- Date:
- Revision:
- Sheet:
- /

### Library data of the parts
C5 C23 = CC0402KRX7R7BB104: as C9 on sheet Microcontroller; Part Number: CC0402KRX7R7BB104; Component Type: Standard; Tolerance: ±10%; Voltage: 16V; Package: 0402; Temperature Coefficient: X7R; Temperature Range: -55°C ~ 125°C; Supplier 1: Digi-Key; Supplier Part Number 1: 311-1338-1-ND

## Sheet Serial IO.SchDoc: Serial I/O Expanders
size Letter; Date: 2017-02-17; Revision: A; SheetNumber: 7; SheetTotal: 11; ProjectTitle: PDUv17: Power Distribution Unit
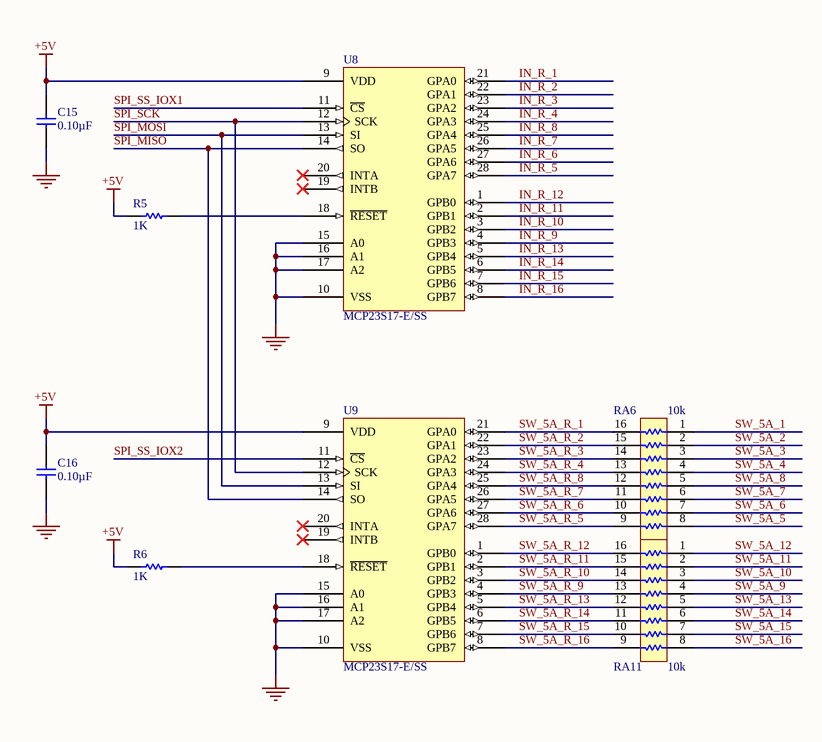
[diagram p6: Serial IO.SchDoc]

### Parts
C15  value 0.10µF  [CAP-0402-M]  (hidden comment: CAP 0.10µF ±10% 16V 0402 X7R)
C16  value 0.10µF  [CAP-0402-M]  (hidden comment: CAP 0.10µF ±10% 16V 0402 X7R)
R5  value 1K  [RES-0603-M]  (hidden comment: RES 1K 1% 1/10 W 0603 ±100ppm/°C)
R6  value 1K  [RES-0603-M]  (hidden comment: RES 1K 1% 1/10 W 0603 ±100ppm/°C)
RA6  value 10k  [CAC-50P379X150-16N]  (hidden comment: MNR18ERAPJ103)
RA11  value 10k  [CAC-50P379X150-16N]  (hidden comment: MNR18ERAPJ103)
U8  MCP23S17-E/SS  [SOP65P780X185-28N]
U9  MCP23S17-E/SS  [SOP65P780X185-28N]

### Nets
+5V: C15.2 C16.2 R5.1 R6.1 U8.9(VDD) U9.9(VDD)
GND: C15.1 C16.1 U8.10(VSS) U8.15(A0) U8.16(A1) U8.17(A2) U9.10(VSS) U9.15(A0) U9.16(A1) U9.17(A2)
IN_R_1: U8.21(GPA0)
IN_R_2: U8.22(GPA1)
IN_R_3: U8.23(GPA2)
IN_R_4: U8.24(GPA3)
IN_R_5: U8.28(GPA7)
IN_R_6: U8.27(GPA6)
IN_R_7: U8.26(GPA5)
IN_R_8: U8.25(GPA4)
IN_R_9: U8.4(GPB3)
IN_R_10: U8.3(GPB2)
IN_R_11: U8.2(GPB1)
IN_R_12: U8.1(GPB0)
IN_R_13: U8.5(GPB4)
IN_R_14: U8.6(GPB5)
IN_R_15: U8.7(GPB6)
IN_R_16: U8.8(GPB7)
SPI_MISO: U8.14(SO) U9.14(SO)
SPI_MOSI: U8.13(SI) U9.13(SI)
SPI_SCK: U8.12(SCK) U9.12(SCK)
SPI_SS_IOX1: U8.11(~{CS})
SPI_SS_IOX2: U9.11(~{CS})
SW_5A_1: RA6.1
SW_5A_2: RA6.2
SW_5A_3: RA6.3
SW_5A_4: RA6.4
SW_5A_5: RA6.8
SW_5A_6: RA6.7
SW_5A_7: RA6.6
SW_5A_8: RA6.5
SW_5A_9: RA11.4
SW_5A_10: RA11.3
SW_5A_11: RA11.2
SW_5A_12: RA11.1
SW_5A_13: RA11.5
SW_5A_14: RA11.6
SW_5A_15: RA11.7
SW_5A_16: RA11.8
SW_5A_R_1: RA6.16 U9.21(GPA0)
SW_5A_R_2: RA6.15 U9.22(GPA1)
SW_5A_R_3: RA6.14 U9.23(GPA2)
SW_5A_R_4: RA6.13 U9.24(GPA3)
SW_5A_R_5: RA6.9 U9.28(GPA7)
SW_5A_R_6: RA6.10 U9.27(GPA6)
SW_5A_R_7: RA6.11 U9.26(GPA5)
SW_5A_R_8: RA6.12 U9.25(GPA4)
SW_5A_R_9: RA11.13 U9.4(GPB3)
SW_5A_R_10: RA11.14 U9.3(GPB2)
SW_5A_R_11: RA11.15 U9.2(GPB1)
SW_5A_R_12: RA11.16 U9.1(GPB0)
SW_5A_R_13: RA11.12 U9.5(GPB4)
SW_5A_R_14: RA11.11 U9.6(GPB5)
SW_5A_R_15: RA11.10 U9.7(GPB6)
SW_5A_R_16: RA11.9 U9.8(GPB7)
NetR5_2: R5.2 U8.18(~{RESET})
NetR6_2: R6.2 U9.18(~{RESET})

Not connected (* = marked no-connect by the designer): U8 19(INTB)* 20(INTA)*; U9 19(INTB)* 20(INTA)*

### Notes on the sheet
- Date:
- Revision:
- Sheet:
- /

### Library data of the parts
C15 C16 = CC0402KRX7R7BB104: as C9 on sheet Microcontroller; Part Number: CC0402KRX7R7BB104; Component Type: Standard; Tolerance: ±10%; Voltage: 16V; Package: 0402; Temperature Coefficient: X7R; Temperature Range: -55°C ~ 125°C; Supplier 1: Digi-Key; Supplier Part Number 1: 311-1338-1-ND
R5 R6 = RC0603FR-071KL: as R8 on sheet Microcontroller; Part Number: RC0603FR-071KL; Component Type: Standard; Tolerance: 1%; Package: 0603; Temperature Coefficient: ±100ppm/°C; Temperature Range: -55°C ~ 155°C; Supplier 1: Digi-Key; Supplier Part Number 1: 311-1.00KHRCT-ND

## Sheet Peripherals.SchDoc: Peripherals
size Letter; Date: 2017-02-17; Revision: A; SheetNumber: 8; SheetTotal: 11; ProjectTitle: PDUv17: Power Distribution Unit
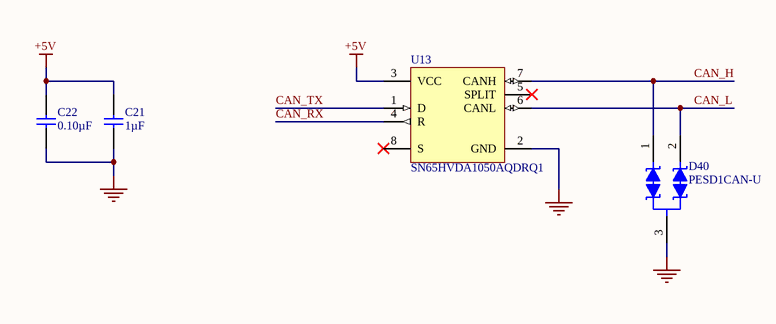
[diagram p7: Peripherals.SchDoc]

### Parts
C21  value 1µF  [CAP-0805-M]  (hidden comment: CAP 1µF ±10% 16V 0805 X7R)
C22  value 0.10µF  [CAP-0402-M]  (hidden comment: CAP 0.10µF ±10% 16V 0402 X7R)
D40  PESD1CAN-U  [SOT65P210X110-3N]
U13  SN65HVDA1050AQDRQ1  [SOIC127P600X175-8M]

### Nets
+5V: C21.1 C22.2 U13.3(VCC)
GND: C21.2 C22.1 D40.3 U13.2(GND)
CAN_H: D40.1 U13.7(CANH)
CAN_L: D40.2 U13.6(CANL)
CAN_RX: U13.4(R)
CAN_TX: U13.1(D)

Not connected (* = marked no-connect by the designer): U13 5(SPLIT)* 8(S)*

### Notes on the sheet
- Date:
- Revision:
- Sheet:
- /

### Library data of the parts
C21 = CC0805KKX7R7BB105: as C6 on sheet Microcontroller; Part Number: CC0805KKX7R7BB105; Component Type: Standard; Tolerance: ±10%; Voltage: 16V; Package: 0805; Temperature Coefficient: X7R; Temperature Range: -55°C ~ 125°C; Supplier 1: Digi-Key; Supplier Part Number 1: 311-1365-1-ND
C22 = CC0402KRX7R7BB104: as C9 on sheet Microcontroller; Part Number: CC0402KRX7R7BB104; Component Type: Standard; Tolerance: ±10%; Voltage: 16V; Package: 0402; Temperature Coefficient: X7R; Temperature Range: -55°C ~ 125°C; Supplier 1: Digi-Key; Supplier Part Number 1: 311-1338-1-ND
U13 = SN65HVDA1050AQDRQ1: CAN transceiver; Supplier 1: Digi-Key; Supplier Part Number 1: 296-25836-1-ND

## Sheet Inputs.SchDoc: Digital and Analog Inputs
size Letter; Date: 2017-02-17; Revision: A; SheetNumber: 9; SheetTotal: 11; ProjectTitle: PDUv17: Power Distribution Unit
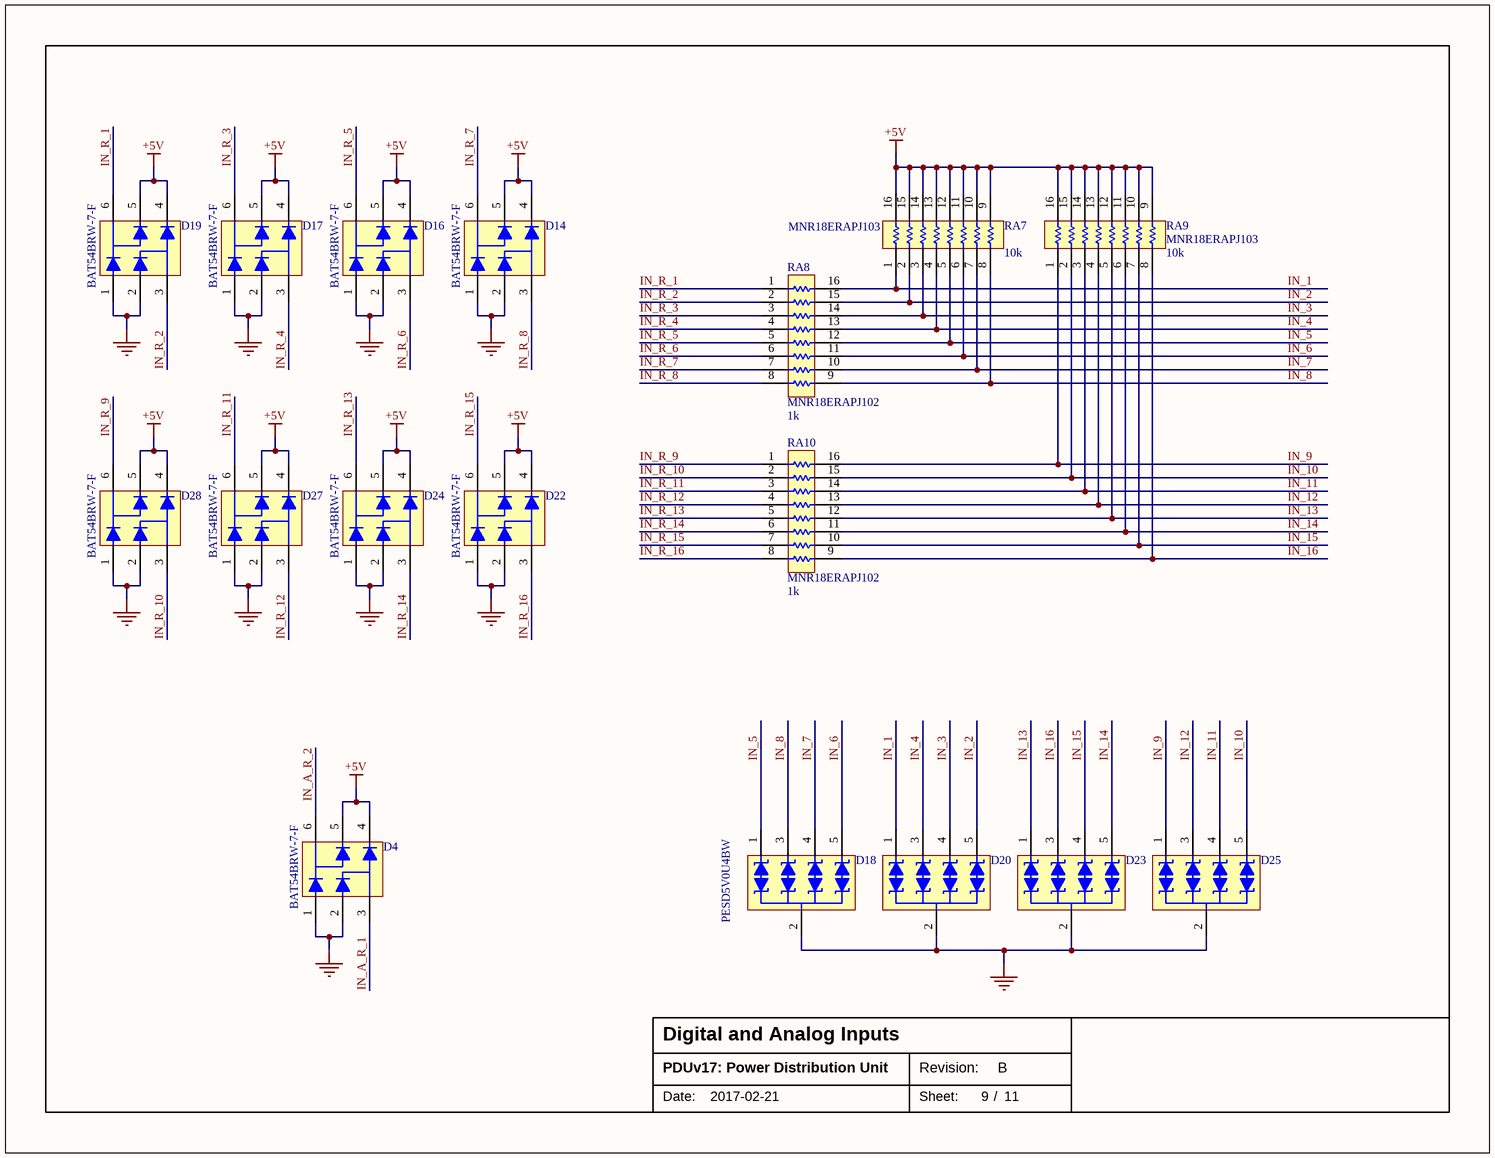
[diagram p8: Inputs.SchDoc]

### Parts
D4  BAT54BRW-7-F  [SOT65P210X110-6N]
D14  BAT54BRW-7-F  [SOT65P210X110-6N]
D16  BAT54BRW-7-F  [SOT65P210X110-6N]
D17  BAT54BRW-7-F  [SOT65P210X110-6N]
D18  PESD5V0U4BW  [SOTFL50P160X60-5N]
D19  BAT54BRW-7-F  [SOT65P210X110-6N]
D20  PESD5V0U4BW  [SOTFL50P160X60-5N]  (value not drawn)
D22  BAT54BRW-7-F  [SOT65P210X110-6N]
D23  PESD5V0U4BW  [SOTFL50P160X60-5N]  (value not drawn)
D24  BAT54BRW-7-F  [SOT65P210X110-6N]
D25  PESD5V0U4BW  [SOTFL50P160X60-5N]  (value not drawn)
D27  BAT54BRW-7-F  [SOT65P210X110-6N]
D28  BAT54BRW-7-F  [SOT65P210X110-6N]
RA7  MNR18ERAPJ103  value 10k  [CAC-50P379X150-16N]
RA8  MNR18ERAPJ102  value 1k  [CAC-50P379X150-16N]
RA9  MNR18ERAPJ103  value 10k  [CAC-50P379X150-16N]
RA10  MNR18ERAPJ102  value 1k  [CAC-50P379X150-16N]

### Nets
+5V: D4.4 D4.5 D14.4 D14.5 D16.4 D16.5 D17.4 D17.5 D19.4 D19.5 D22.4 D22.5 D24.4 D24.5 D27.4 D27.5 D28.4 D28.5 RA7.9 RA7.10 RA7.11 RA7.12 RA7.13 RA7.14 RA7.15 RA7.16 RA9.9 RA9.10 RA9.11 RA9.12 RA9.13 RA9.14 RA9.15 RA9.16
GND: D4.1 D4.2 D14.1 D14.2 D16.1 D16.2 D17.1 D17.2 D18.2 D19.1 D19.2 D20.2 D22.1 D22.2 D23.2 D24.1 D24.2 D25.2 D27.1 D27.2 D28.1 D28.2
IN_1: D20.1 RA7.1 RA8.16
IN_2: D20.5 RA7.2 RA8.15
IN_3: D20.4 RA7.3 RA8.14
IN_4: D20.3 RA7.4 RA8.13
IN_5: D18.1 RA7.5 RA8.12
IN_6: D18.5 RA7.6 RA8.11
IN_7: D18.4 RA7.7 RA8.10
IN_8: D18.3 RA7.8 RA8.9
IN_9: D25.1 RA9.1 RA10.16
IN_10: D25.5 RA9.2 RA10.15
IN_11: D25.4 RA9.3 RA10.14
IN_12: D25.3 RA9.4 RA10.13
IN_13: D23.1 RA9.5 RA10.12
IN_14: D23.5 RA9.6 RA10.11
IN_15: D23.4 RA9.7 RA10.10
IN_16: D23.3 RA9.8 RA10.9
IN_A_R_1: D4.3
IN_A_R_2: D4.6
IN_R_1: D19.6 RA8.1
IN_R_2: D19.3 RA8.2
IN_R_3: D17.6 RA8.3
IN_R_4: D17.3 RA8.4
IN_R_5: D16.6 RA8.5
IN_R_6: D16.3 RA8.6
IN_R_7: D14.6 RA8.7
IN_R_8: D14.3 RA8.8
IN_R_9: D28.6 RA10.1
IN_R_10: D28.3 RA10.2
IN_R_11: D27.6 RA10.3
IN_R_12: D27.3 RA10.4
IN_R_13: D24.6 RA10.5
IN_R_14: D24.3 RA10.6
IN_R_15: D22.6 RA10.7
IN_R_16: D22.3 RA10.8

### Notes on the sheet
- Date:
- Revision:
- Sheet:
- /

## Sheet Connectors.SchDoc: Connectors
size Letter; Date: 2017-02-17; Revision: A; SheetNumber: 10; SheetTotal: 11; ProjectTitle: PDUv17: Power Distribution Unit
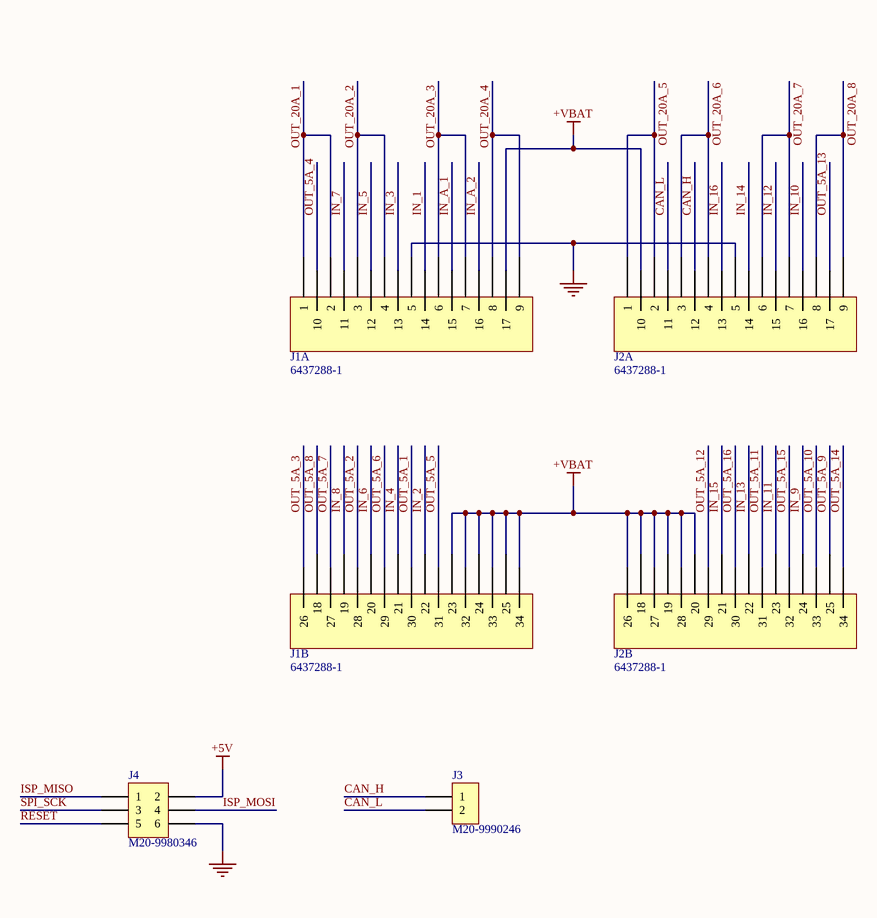
[diagram p9: Connectors.SchDoc]

### Parts
J1  6437288-1  [6437288-1]  (parts A,B of 2)
J2  6437288-1  [6437288-1]  (parts A,B of 2)
J3  M20-9990246  [M20-9990246]
J4  M20-9980346  [M20-9980346]

### Nets
+5V: J4.2
+VBAT: J1.17 J1.23 J1.24 J1.25 J1.32 J1.33 J1.34 J2.10 J2.18 J2.19 J2.20 J2.26 J2.27 J2.28
GND: J1.5 J2.5 J4.6
CAN_H: J2.12 J3.1
CAN_L: J2.11 J3.2
IN_1: J1.14
IN_2: J1.22
IN_3: J1.13
IN_4: J1.21
IN_5: J1.12
IN_6: J1.20
IN_7: J1.11
IN_8: J1.19
IN_9: J2.24
IN_10: J2.16
IN_11: J2.23
IN_12: J2.15
IN_13: J2.22
IN_14: J2.14
IN_15: J2.21
IN_16: J2.13
IN_A_1: J1.15
IN_A_2: J1.16
ISP_MISO: J4.1
ISP_MOSI: J4.4
OUT_5A_1: J1.30
OUT_5A_2: J1.28
OUT_5A_3: J1.26
OUT_5A_4: J1.10
OUT_5A_5: J1.31
OUT_5A_6: J1.29
OUT_5A_7: J1.27
OUT_5A_8: J1.18
OUT_5A_9: J2.25
OUT_5A_10: J2.33
OUT_5A_11: J2.31
OUT_5A_12: J2.29
OUT_5A_13: J2.17
OUT_5A_14: J2.34
OUT_5A_15: J2.32
OUT_5A_16: J2.30
OUT_20A_1: J1.1 J1.2
OUT_20A_2: J1.3 J1.4
OUT_20A_3: J1.6 J1.7
OUT_20A_4: J1.8 J1.9
OUT_20A_5: J2.1 J2.2
OUT_20A_6: J2.3 J2.4
OUT_20A_7: J2.6 J2.7
OUT_20A_8: J2.8 J2.9
~{RESET}: J4.5
SPI_SCK: J4.3

### Notes on the sheet
- Date:
- Revision:
- Sheet:
- /

### Library data of the parts
J1 J2 = 6437288-1: Superseal 34-way right angle PCB header
J3 = M20-9990246: 2.54mm Header 1x2-Pin; Supplier 1: Digi-Key; Supplier Part Number 1: 952-2262-ND
J4 = M20-9980346: 2.54mm Header 2x3-Pin; Supplier 1: Digi-Key; Supplier Part Number 1: 952-2121-ND

## Sheet Mechanical.SchDoc: Mechanical
size Letter; Date: 2017-02-17; Revision: A; SheetNumber: 11; SheetTotal: 11; ProjectTitle: PDUv17: Power Distribution Unit
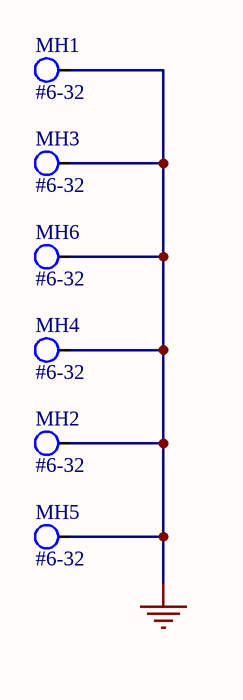
[diagram p10: Mechanical.SchDoc]

### Parts
MH1  #6-32  [MH-6-32]
MH2  #6-32  [MH-6-32]
MH3  #6-32  [MH-6-32]
MH4  #6-32  [MH-6-32]
MH5  #6-32  [MH-6-32]
MH6  #6-32  [MH-6-32]

### Nets
GND: MH1.1 MH2.1 MH3.1 MH4.1 MH5.1 MH6.1

### Notes on the sheet
- Date:
- Revision:
- Sheet:
- /

### Library data of the parts
MH1-MH6 = MH-6-32

## Nets that join several sheets
+5V: Power (C3.2 U4.2 U4.4), Microcontroller (8 pins), Drivers - High Current (8 pins), Multiplexers (C5.2 C23.2 U6.16 U12.16), Serial IO (6 pins), Peripherals (C21.1 C22.2 U13.3), Inputs (34 pins), Connectors (J4.2)
+VBAT: Power (6 pins), Drivers - Low Current (12 pins), Drivers - High Current (U2.37 U5.37 U10.37 U14.37), Connectors (14 pins)
GND: Power (11 pins), Microcontroller (18 pins), Drivers - Low Current (40 pins), Drivers - High Current (16 pins), Multiplexers (24 pins), Serial IO (10 pins), Peripherals (C21.2 C22.1 D40.3 U13.2), Inputs (22 pins), Connectors (J1.5 J2.5 J4.6), Mechanical (6 pins)
CAN_H: Peripherals (D40.1 U13.7), Connectors (J2.12 J3.1)
CAN_L: Peripherals (D40.2 U13.6), Connectors (J2.11 J3.2)
CAN_RX: Microcontroller (U7.31), Peripherals (U13.4)
CAN_TX: Microcontroller (U7.30), Peripherals (U13.1)
IN_1: Inputs (D20.1 RA7.1 RA8.16), Connectors (J1.14)
IN_2: Inputs (D20.5 RA7.2 RA8.15), Connectors (J1.22)
IN_3: Inputs (D20.4 RA7.3 RA8.14), Connectors (J1.13)
IN_4: Inputs (D20.3 RA7.4 RA8.13), Connectors (J1.21)
IN_5: Inputs (D18.1 RA7.5 RA8.12), Connectors (J1.12)
IN_6: Inputs (D18.5 RA7.6 RA8.11), Connectors (J1.20)
IN_7: Inputs (D18.4 RA7.7 RA8.10), Connectors (J1.11)
IN_8: Inputs (D18.3 RA7.8 RA8.9), Connectors (J1.19)
IN_9: Inputs (D25.1 RA9.1 RA10.16), Connectors (J2.24)
IN_10: Inputs (D25.5 RA9.2 RA10.15), Connectors (J2.16)
IN_11: Inputs (D25.4 RA9.3 RA10.14), Connectors (J2.23)
IN_12: Inputs (D25.3 RA9.4 RA10.13), Connectors (J2.15)
IN_13: Inputs (D23.1 RA9.5 RA10.12), Connectors (J2.22)
IN_14: Inputs (D23.5 RA9.6 RA10.11), Connectors (J2.14)
IN_15: Inputs (D23.4 RA9.7 RA10.10), Connectors (J2.21)
IN_16: Inputs (D23.3 RA9.8 RA10.9), Connectors (J2.13)
IN_A_1: Microcontroller (RA1.5), Connectors (J1.15)
IN_A_2: Microcontroller (RA1.6), Connectors (J1.16)
IN_A_R_1: Microcontroller (CA1.5 RA1.4 U7.54), Inputs (D4.3)
IN_A_R_2: Microcontroller (CA1.6 RA1.3 U7.55), Inputs (D4.6)
IN_R_1: Serial IO (U8.21), Inputs (D19.6 RA8.1)
IN_R_2: Serial IO (U8.22), Inputs (D19.3 RA8.2)
IN_R_3: Serial IO (U8.23), Inputs (D17.6 RA8.3)
IN_R_4: Serial IO (U8.24), Inputs (D17.3 RA8.4)
IN_R_5: Serial IO (U8.28), Inputs (D16.6 RA8.5)
IN_R_6: Serial IO (U8.27), Inputs (D16.3 RA8.6)
IN_R_7: Serial IO (U8.26), Inputs (D14.6 RA8.7)
IN_R_8: Serial IO (U8.25), Inputs (D14.3 RA8.8)
IN_R_9: Serial IO (U8.4), Inputs (D28.6 RA10.1)
IN_R_10: Serial IO (U8.3), Inputs (D28.3 RA10.2)
IN_R_11: Serial IO (U8.2), Inputs (D27.6 RA10.3)
IN_R_12: Serial IO (U8.1), Inputs (D27.3 RA10.4)
IN_R_13: Serial IO (U8.5), Inputs (D24.6 RA10.5)
IN_R_14: Serial IO (U8.6), Inputs (D24.3 RA10.6)
IN_R_15: Serial IO (U8.7), Inputs (D22.6 RA10.7)
IN_R_16: Serial IO (U8.8), Inputs (D22.3 RA10.8)
IS_5A_1: Drivers - Low Current (RA3.5 U1.10), Multiplexers (RA4.1)
IS_5A_2: Drivers - Low Current (RA3.6 U1.8), Multiplexers (RA4.2)
IS_5A_3: Drivers - Low Current (RA3.7 U1.6), Multiplexers (RA4.3)
IS_5A_4: Drivers - Low Current (RA3.8 U1.4), Multiplexers (RA4.4)
IS_5A_5: Drivers - Low Current (RA5.5 U3.10), Multiplexers (RA4.5)
IS_5A_6: Drivers - Low Current (RA5.6 U3.8), Multiplexers (RA4.6)
IS_5A_7: Drivers - Low Current (RA5.7 U3.6), Multiplexers (RA4.7)
IS_5A_8: Drivers - Low Current (RA5.8 U3.4), Multiplexers (RA4.8)
IS_5A_9: Drivers - Low Current (RA12.5 U11.10), Multiplexers (RA13.1)
IS_5A_10: Drivers - Low Current (RA12.6 U11.8), Multiplexers (RA13.2)
IS_5A_11: Drivers - Low Current (RA12.7 U11.6), Multiplexers (RA13.3)
IS_5A_12: Drivers - Low Current (RA12.8 U11.4), Multiplexers (RA13.4)
IS_5A_13: Drivers - Low Current (RA14.5 U15.10), Multiplexers (RA13.5)
IS_5A_14: Drivers - Low Current (RA14.6 U15.8), Multiplexers (RA13.6)
IS_5A_15: Drivers - Low Current (RA14.7 U15.6), Multiplexers (RA13.7)
IS_5A_16: Drivers - Low Current (RA14.8 U15.4), Multiplexers (RA13.8)
IS_5A_MUX1: Microcontroller (U7.58), Multiplexers (U6.3)
IS_5A_MUX2: Microcontroller (U7.59), Multiplexers (U12.3)
IS_20A_12: Microcontroller (RA1.7), Drivers - High Current (R1.2 U2.21)
IS_20A_34: Microcontroller (RA1.8), Drivers - High Current (R3.2 U5.21)
IS_20A_56: Microcontroller (R13.1), Drivers - High Current (R7.2 U10.21)
IS_20A_78: Microcontroller (R12.1), Drivers - High Current (R10.2 U14.21)
IS_MUX_A: Microcontroller (U7.4), Multiplexers (U6.11 U12.11)
IS_MUX_B: Microcontroller (U7.5), Multiplexers (U6.10 U12.10)
IS_MUX_C: Microcontroller (U7.6), Multiplexers (U6.9 U12.9)
ISP_MISO: Microcontroller (U7.3), Connectors (J4.1)
ISP_MOSI: Microcontroller (U7.2), Connectors (J4.4)
OUT_5A_1: Drivers - Low Current (D2.2 U1.13 U1.14 U1.15), Connectors (J1.30)
OUT_5A_2: Drivers - Low Current (D3.2 U1.16 U1.17 U1.18), Connectors (J1.28)
OUT_5A_3: Drivers - Low Current (D5.2 U1.19 U1.20 U1.21), Connectors (J1.26)
OUT_5A_4: Drivers - Low Current (D7.2 U1.22 U1.23 U1.24), Connectors (J1.10)
OUT_5A_5: Drivers - Low Current (D9.2 U3.13 U3.14 U3.15), Connectors (J1.31)
OUT_5A_6: Drivers - Low Current (D11.2 U3.16 U3.17 U3.18), Connectors (J1.29)
OUT_5A_7: Drivers - Low Current (D12.2 U3.19 U3.20 U3.21), Connectors (J1.27)
OUT_5A_8: Drivers - Low Current (D13.2 U3.22 U3.23 U3.24), Connectors (J1.18)
OUT_5A_9: Drivers - Low Current (D29.2 U11.13 U11.14 U11.15), Connectors (J2.25)
OUT_5A_10: Drivers - Low Current (D30.2 U11.16 U11.17 U11.18), Connectors (J2.33)
OUT_5A_11: Drivers - Low Current (D31.2 U11.19 U11.20 U11.21), Connectors (J2.31)
OUT_5A_12: Drivers - Low Current (D33.2 U11.22 U11.23 U11.24), Connectors (J2.29)
OUT_5A_13: Drivers - Low Current (D35.2 U15.13 U15.14 U15.15), Connectors (J2.17)
OUT_5A_14: Drivers - Low Current (D36.2 U15.16 U15.17 U15.18), Connectors (J2.34)
OUT_5A_15: Drivers - Low Current (D37.2 U15.19 U15.20 U15.21), Connectors (J2.32)
OUT_5A_16: Drivers - Low Current (D39.2 U15.22 U15.23 U15.24), Connectors (J2.30)
OUT_20A_1: Drivers - High Current (11 pins), Connectors (J1.1 J1.2)
OUT_20A_2: Drivers - High Current (11 pins), Connectors (J1.3 J1.4)
OUT_20A_3: Drivers - High Current (11 pins), Connectors (J1.6 J1.7)
OUT_20A_4: Drivers - High Current (11 pins), Connectors (J1.8 J1.9)
OUT_20A_5: Drivers - High Current (11 pins), Connectors (J2.1 J2.2)
OUT_20A_6: Drivers - High Current (11 pins), Connectors (J2.3 J2.4)
OUT_20A_7: Drivers - High Current (11 pins), Connectors (J2.6 J2.7)
OUT_20A_8: Drivers - High Current (11 pins), Connectors (J2.8 J2.9)
~{RESET}: Microcontroller (R8.2 U7.20), Connectors (J4.5)
SEL0: Microcontroller (U7.40), Drivers - High Current (U2.17 U5.17 U10.17 U14.17)
SEL1: Microcontroller (U7.41), Drivers - High Current (U2.16 U5.16 U10.16 U14.16)
SPI_MISO: Microcontroller (U7.13), Serial IO (U8.14 U9.14)
SPI_MOSI: Microcontroller (U7.12), Serial IO (U8.13 U9.13)
SPI_SCK: Microcontroller (U7.11), Serial IO (U8.12 U9.12), Connectors (J4.3)
SPI_SS_IOX1: Microcontroller (U7.10), Serial IO (U8.11)
SPI_SS_IOX2: Microcontroller (U7.14), Serial IO (U9.11)
SW_5A_1: Drivers - Low Current (U1.9), Serial IO (RA6.1)
SW_5A_2: Drivers - Low Current (U1.7), Serial IO (RA6.2)
SW_5A_3: Drivers - Low Current (U1.5), Serial IO (RA6.3)
SW_5A_4: Drivers - Low Current (U1.3), Serial IO (RA6.4)
SW_5A_5: Drivers - Low Current (U3.9), Serial IO (RA6.8)
SW_5A_6: Drivers - Low Current (U3.7), Serial IO (RA6.7)
SW_5A_7: Drivers - Low Current (U3.5), Serial IO (RA6.6)
SW_5A_8: Drivers - Low Current (U3.3), Serial IO (RA6.5)
SW_5A_9: Drivers - Low Current (U11.9), Serial IO (RA11.4)
SW_5A_10: Drivers - Low Current (U11.7), Serial IO (RA11.3)
SW_5A_11: Drivers - Low Current (U11.5), Serial IO (RA11.2)
SW_5A_12: Drivers - Low Current (U11.3), Serial IO (RA11.1)
SW_5A_13: Drivers - Low Current (U15.9), Serial IO (RA11.5)
SW_5A_14: Drivers - Low Current (U15.7), Serial IO (RA11.6)
SW_5A_15: Drivers - Low Current (U15.5), Serial IO (RA11.7)
SW_5A_16: Drivers - Low Current (U15.3), Serial IO (RA11.8)
SW_20A_1: Microcontroller (RA2.5), Drivers - High Current (U2.23)
SW_20A_2: Microcontroller (RA2.6), Drivers - High Current (U2.22)
SW_20A_3: Microcontroller (RA2.7), Drivers - High Current (U5.23)
SW_20A_4: Microcontroller (RA2.8), Drivers - High Current (U5.22)
SW_20A_5: Microcontroller (RA15.5), Drivers - High Current (U10.23)
SW_20A_6: Microcontroller (RA15.6), Drivers - High Current (U10.22)
SW_20A_7: Microcontroller (RA15.7), Drivers - High Current (U14.23)
SW_20A_8: Microcontroller (RA15.8), Drivers - High Current (U14.22)